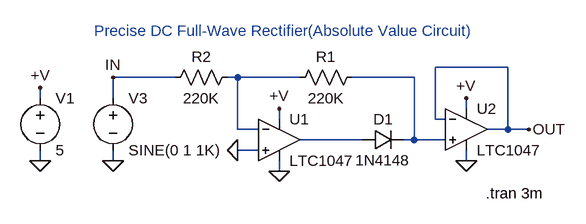
[diagram p0: schematic 1047.asc]
1047.asc, the LTspice schematic file:
Version 4
SHEET 1 896 680
WIRE 544 128 432 128
WIRE 32 144 -64 144
WIRE 128 144 112 144
WIRE 224 144 128 144
WIRE 400 144 304 144
WIRE -176 176 -176 160
WIRE -64 176 -64 144
WIRE 480 192 480 176
WIRE 192 208 192 192
WIRE 432 208 432 128
WIRE 448 208 432 208
WIRE 128 224 128 144
WIRE 160 224 128 224
WIRE 544 224 544 128
WIRE 544 224 512 224
WIRE 576 224 544 224
WIRE 320 240 224 240
WIRE 400 240 400 144
WIRE 400 240 384 240
WIRE 448 240 400 240
WIRE 160 256 128 256
WIRE -176 272 -176 256
WIRE -64 272 -64 256
WIRE 480 272 480 256
WIRE 192 288 192 272
FLAG -176 272 0
FLAG 192 192 +V
FLAG -176 160 +V
FLAG -64 272 0
FLAG 192 288 0
FLAG 480 176 +V
FLAG 480 272 0
FLAG 128 256 0
FLAG 576 224 OUT
FLAG -64 144 IN
SYMBOL voltage -176 160 R0
SYMATTR InstName V1
SYMATTR Value 5
SYMBOL res 320 128 R90
WINDOW 0 0 56 VBottom 0
WINDOW 3 32 56 VTop 0
SYMATTR InstName R1
SYMATTR Value 220K
SYMBOL res 128 128 R90
WINDOW 0 0 56 VBottom 0
WINDOW 3 32 56 VTop 0
SYMATTR InstName R2
SYMATTR Value 220K
SYMBOL voltage -64 160 R0
SYMATTR InstName V3
SYMATTR Value SINE(0 1 1K)
SYMBOL opamps\\LTC1047 192 176 R0
SYMATTR InstName U1
SYMBOL diode 320 256 R270
WINDOW 0 32 32 VTop 0
WINDOW 3 0 32 VBottom 0
SYMATTR InstName D1
SYMATTR Value 1N4148
SYMBOL opamps\\LTC1047 480 160 R0
SYMATTR InstName U2
TEXT 510 322 Left 0 !.tran 3m
TEXT 200 88 Bottom 0 ;Precise DC Full-Wave Rectifier(Absolute Value Circuit)

The netlist it stands for:
* 1047.asc
V1 +V 0 5
R1 N002 N001 220K
R2 N001 IN 220K
V3 IN 0 SINE(0 1 1K)
XU1 0 N001 +V 0 N003 LTC1047  ; pins In+ In- V+ V- OUT
D1 N003 N002 1N4148
XU2 N002 OUT +V 0 OUT LTC1047  ; pins In+ In- V+ V- OUT
.model D D
.lib standard.dio
.tran 3m
* Precise DC Full-Wave Rectifier(Absolute Value Circuit)
.backanno
.end